# Altium schematic sheet DC_Motor.SchDoc
size A4
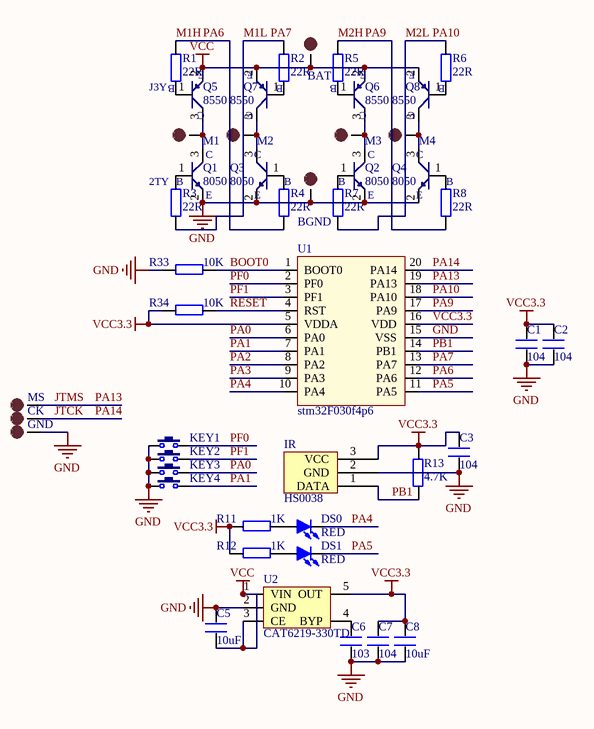
[diagram p0: DC_Motor.SchDoc]

## Parts
BAT  TEST  [TP-1.5]  (value not drawn)
BGND  TEST  [TP-1.5]  (value not drawn)
C1  104  [C 0603_L]
C2  104  [C 0603_L]
C3  104  [C 0603_L]
C5  10uF  [C 0603_L]
C6  103  [C 0603_L]
C7  104  [C 0603_L]
C8  10uF  [C 0603_L]
CK  TEST POINT  [TP-1.5]  (value not drawn)
DS0  RED  [LED 0805R]
DS1  RED  [LED 0805R]
GND  TEST POINT  [TP-1.5]  (value not drawn)
IR  HS0038  [29-04]
KEY1  KEY  [TSW DIP-6*6*5 - 2]  (value not drawn)
KEY2  KEY  [TSW DIP-6*6*5 - 2]  (value not drawn)
KEY3  KEY  [TSW DIP-6*6*5 - 2]  (value not drawn)
KEY4  KEY  [TSW DIP-6*6*5 - 2]  (value not drawn)
M1  TEST  [TP-1.5]  (value not drawn)
M2  TEST  [TP-1.5]  (value not drawn)
M3  TEST  [TP-1.5]  (value not drawn)
M4  TEST  [TP-1.5]  (value not drawn)
MS  TEST POINT  [TP-1.5]  (value not drawn)
Q1  8050  [SOT23-3L]
Q2  8050  [SOT23-3L]
Q3  8050  [SOT23-3L]
Q4  8050  [SOT23-3L]
Q5  8550  [SOT23-3L]
Q6  8550  [SOT23-3L]
Q7  8550  [SOT23-3L]
Q8  8550  [SOT23-3L]
R1  22R  [R 0603_L]
R2  22R  [R 0603_L]
R3  22R  [R 0603_L]
R4  22R  [R 0603_L]
R5  22R  [R 0603_L]
R6  22R  [R 0603_L]
R7  22R  [R 0603_L]
R8  22R  [R 0603_L]
R11  1K  [R 0603_L]
R12  1K  [R 0603_L]
R13  4.7K  [R 0603_L]
R33  10K  [R 0603_L]
R34  10K  [R 0603_L]
U1  stm32F030f4p6  [TSSOP20_N]
U2  CAT6219-330TD  [SOT23-5L]

## Nets
GND: BGND.1 C1.1 C2.1 C3.1 C5.2 C6.1 C7.1 C8.1 GND.1 IR.2(GND) KEY1.1 KEY2.1 KEY3.1 KEY4.1 Q1.2(E) Q2.2(E) Q3.2(E) Q4.2(E) R33.2 U1.15(VSS) U2.2(GND)
VCC: BAT.1 C5.1 Q5.2(E) Q6.2(E) Q7.2(E) Q8.2(E) U2.1(VIN) U2.3(CE)
VCC3.3: C1.2 C2.2 C3.2 C7.2 C8.2 IR.3(VCC) R11.2 R12.2 R13.1 R34.2 U1.5(VDDA) U1.16(VDD) U2.5(OUT)
BOOT0: R33.1 U1.1(BOOT0)
JTCK: CK.1 U1.20(PA14)  [also labelled PA14]
JTMS: MS.1 U1.19(PA13)  [also labelled PA13]
M1H: R1.2 R4.1 U1.12(PA6)  [also labelled PA6]
M1L: R2.2 R3.1 U1.13(PA7)  [also labelled PA7]
M2H: R5.2 R8.1 U1.17(PA9)  [also labelled PA9]
M2L: R6.2 R7.1 U1.18(PA10)  [also labelled PA10]
PA0: KEY3.2 U1.6(PA0)
PA1: KEY4.2 U1.7(PA1)
PA2: U1.8(PA2)
PA3: U1.9(PA3)
PA4: DS0.2(K) U1.10(PA4)
PA5: DS1.2(K) U1.11(PA5)
PB1: IR.1(DATA) R13.2 U1.14(PB1)
PF0: KEY1.2 U1.2(PF0)
PF1: KEY2.2 U1.3(PF1)
RESET: R34.1 U1.4(RST)
NetC6_2: C6.2 U2.4(BYP)
NetDS0_1: DS0.1(A) R11.1
NetDS1_1: DS1.1(A) R12.1
NetM1_1: M1.1 Q1.3(C) Q5.3(C)
NetM2_1: M2.1 Q3.3(C) Q7.3(C)
NetM3_1: M3.1 Q2.3(C) Q6.3(C)
NetM4_1: M4.1 Q4.3(C) Q8.3(C)
NetQ1_1: Q1.1(B) R3.2
NetQ2_1: Q2.1(B) R7.2
NetQ3_1: Q3.1(B) R4.2
NetQ4_1: Q4.1(B) R8.2
NetQ5_1: Q5.1(B) R1.1
NetQ6_1: Q6.1(B) R5.1
NetQ7_1: Q7.1(B) R2.1
NetQ8_1: Q8.1(B) R6.1

## Notes on the sheet
- (near R1) J3Y
- (near R3) 2TY

## Library data of the parts
BAT BGND CK GND M1-M4 MS = TEST-POINT: 测试点
C1-C3 C5-C8 = C
DS0 DS1 = LED-SMD: 贴片LED; 版权归属: 源创客; BOM名称: 贴片LED; 学习资源: www.ooocke.com
KEY1-KEY4 = KEY: 按键; BOM名称: 3x6轻触开关; 版权归属: 源创客; 学习资源: www.ooocke.com
Q1-Q4 = 8050NPN
Q5-Q8 = 8550PNP
R1-R8 R11-R13 R33 R34 = R
U1 = stm32f030
U2 = CAT6219-330TD: 3.3V 500mA LDO